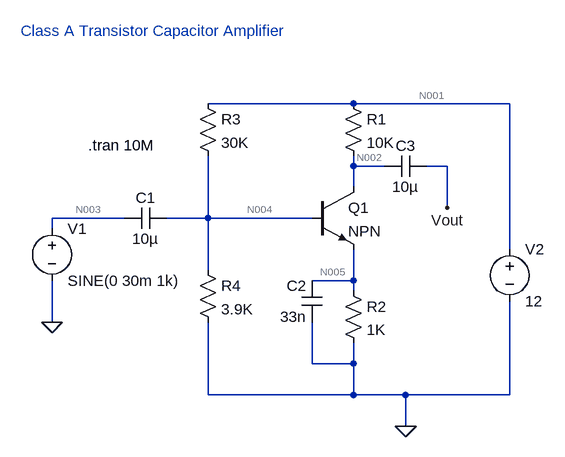
[diagram p0: schematic Class A Transistor Amplifier.asc]
Class A Transistor Amplifier.asc, the LTspice schematic file:
Version 4
SHEET 1 880 680
WIRE 288 0 64 0
WIRE 528 0 288 0
WIRE 288 96 288 80
WIRE 336 96 288 96
WIRE 432 96 400 96
WIRE 288 128 288 96
WIRE 432 160 432 96
WIRE -64 176 -176 176
WIRE 64 176 64 80
WIRE 64 176 0 176
WIRE 224 176 64 176
WIRE -176 192 -176 176
WIRE 528 224 528 0
WIRE 64 256 64 176
WIRE 288 272 288 224
WIRE 288 272 224 272
WIRE 288 288 288 272
WIRE -176 336 -176 272
WIRE 224 400 224 336
WIRE 288 400 288 368
WIRE 288 400 224 400
WIRE 64 448 64 336
WIRE 288 448 288 400
WIRE 288 448 64 448
WIRE 368 448 288 448
WIRE 528 448 528 304
WIRE 528 448 368 448
WIRE 368 496 368 448
FLAG -176 336 0
FLAG 368 496 0
FLAG 432 160 Vout
SYMBOL npn 224 128 R0
SYMATTR InstName Q1
SYMBOL res 272 -16 R0
SYMATTR InstName R1
SYMATTR Value 10K
SYMBOL res 272 272 R0
SYMATTR InstName R2
SYMATTR Value 1K
SYMBOL res 48 -16 R0
SYMATTR InstName R3
SYMATTR Value 30K
SYMBOL res 48 240 R0
SYMATTR InstName R4
SYMATTR Value 3.9K
SYMBOL voltage -176 176 R0
WINDOW 123 0 0 Left 0
WINDOW 39 0 0 Left 0
SYMATTR InstName V1
SYMATTR Value SINE(0 30m 1k)
SYMBOL voltage 528 208 R0
WINDOW 123 0 0 Left 0
WINDOW 39 0 0 Left 0
SYMATTR InstName V2
SYMATTR Value 12
SYMBOL cap 0 160 R90
WINDOW 0 0 32 VBottom 2
WINDOW 3 32 32 VTop 2
SYMATTR InstName C1
SYMATTR Value 10µ
SYMBOL cap 240 336 R180
WINDOW 0 24 56 Left 2
WINDOW 3 24 8 Left 2
SYMATTR InstName C2
SYMATTR Value 33n
SYMBOL cap 400 80 R90
WINDOW 0 0 32 VBottom 2
WINDOW 3 32 32 VTop 2
SYMATTR InstName C3
SYMATTR Value 10µ
TEXT -120 64 Left 2 !.tran 10M
TEXT -224 -112 Left 2 ;Class A Transistor Capacitor Amplifier

The netlist it stands for:
* Class A Transistor Amplifier.asc
Q1 N002 N004 N005 0 NPN
R1 N001 N002 10K
R2 N005 0 1K
R3 N001 N004 30K
R4 N004 0 3.9K
V1 N003 0 SINE(0 30m 1k)
V2 N001 0 12
C1 N004 N003 10µ
C2 0 N005 33n
C3 Vout N002 10µ
.model NPN NPN
.model PNP PNP
.lib standard.bjt
.tran 10M
* Class A Transistor Capacitor Amplifier
.backanno
.end

* Results of the author's LTspice run, read from the files saved beside the schematic
* Operating Point, zero values left out:
*   V(n002) = 6.066 V
*   V(n004) = 1.36 V
*   V(n005) = 599.3 mV
*   V(n001) = 12 V
*   V(vout) = 60.66 µV
*   Ic(Q1) = 593.4 µA
*   Ib(Q1) = 5.934 µA
*   Ie(Q1) = -599.3 µA
*   I(R1) = 593.4 µA
*   I(R2) = 599.3 µA
*   I(R3) = 354.7 µA
*   I(R4) = 348.7 µA
*   I(V2) = -948.1 µA
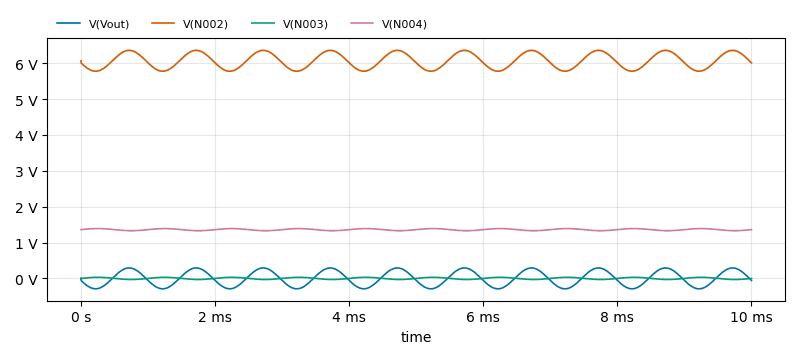
[diagram p1: Transient Analysis of Class A Transistor Amplifier.asc, plotted from the saved traces]
* Transient Analysis, 1 run:
*   V(Vout): min -289.6 mV, max 291.6 mV, average 1.094 mV, rms 205.4 mV, last -56.92 mV
*   V(N002): min 5.776 V, max 6.358 V, average 6.067 V, rms 6.071 V, last 6.009 V
*   V(N003): min -30 mV, max 30 mV, average 0 V, rms 21.21 mV, last 0 V
*   V(N004): min 1.33 V, max 1.39 V, average 1.36 V, rms 1.36 V, last 1.36 V